# Altium schematic sheet Digital.SchDoc
size A4
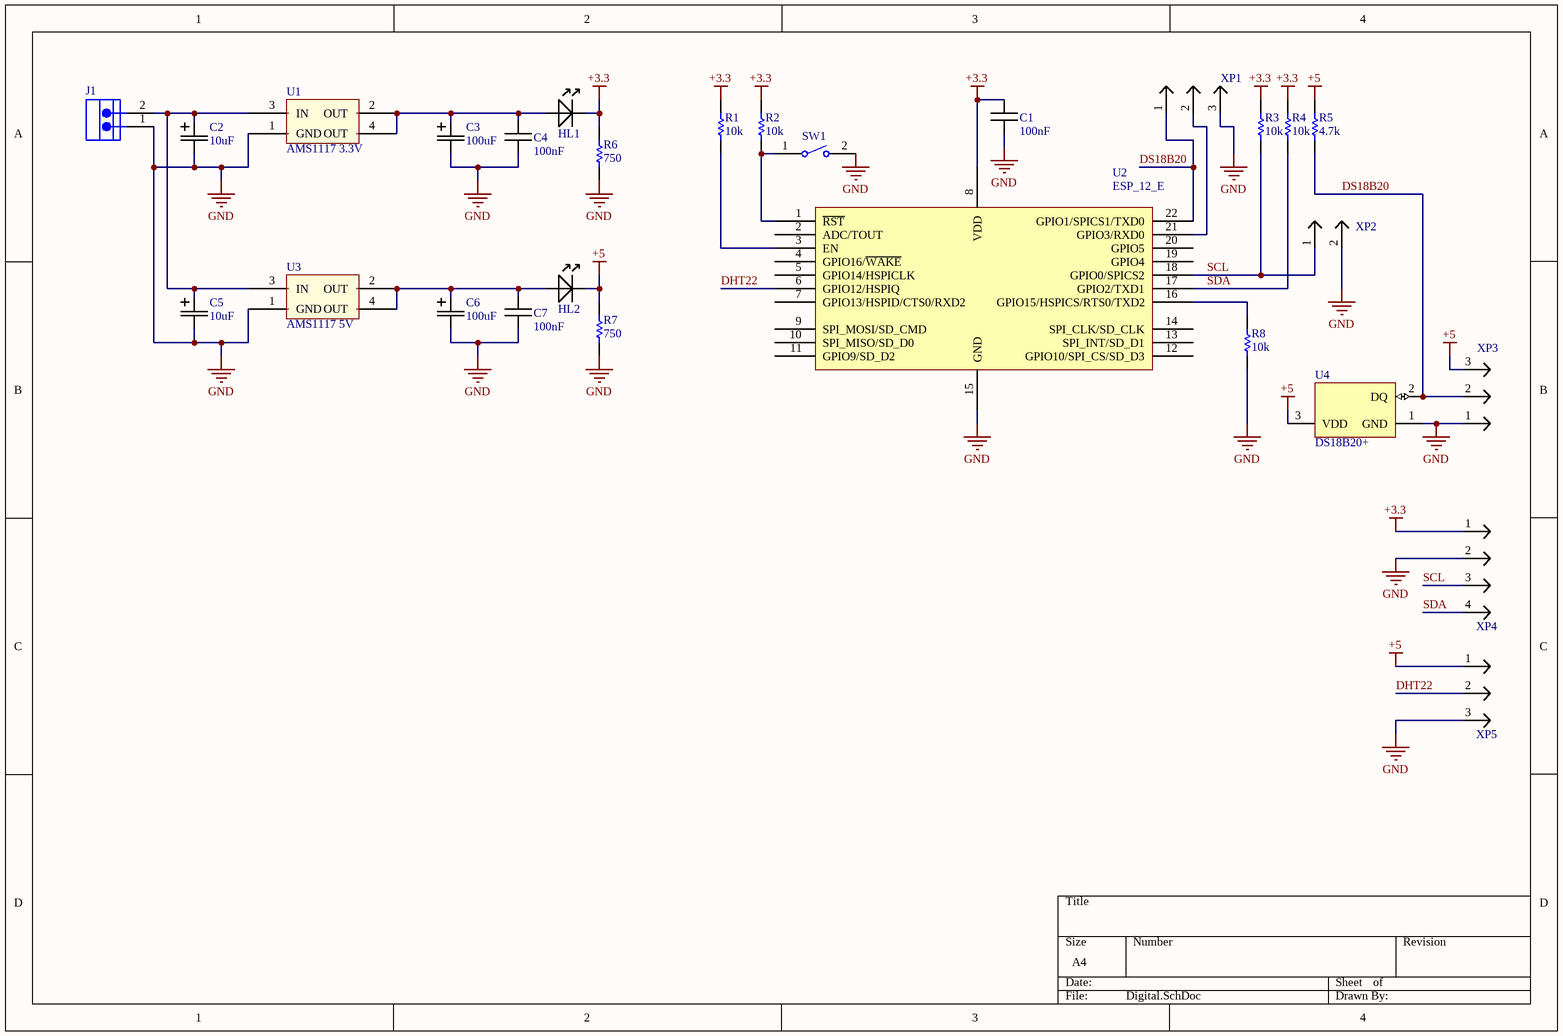
[diagram p0: Digital.SchDoc]

## Parts
C1  Val: 100nF  [CAP0805]  (hidden comment: CAP_SMD)
C2  Val: 10uF  [CAP_ELEC_5*11]  (hidden comment: CAP_ELEC_5*11)
C3  Val: 100uF  [CAP_ELEC_8*11]  (hidden comment: CAP_ELEC_8*11)
C4  Val: 100nF  [CAP0805]  (hidden comment: CAP_SMD)
C5  Val: 10uF  [CAP_ELEC_5*11]  (hidden comment: CAP_ELEC_5*11)
C6  Val: 100uF  [CAP_ELEC_8*11]  (hidden comment: CAP_ELEC_8*11)
C7  Val: 100nF  [CAP0805]  (hidden comment: CAP_SMD)
HL1  LED_SMD  [1206_Led]  (value not drawn)
HL2  LED_SMD  [1206_Led]  (value not drawn)
J1  (no value)  [KF350-3.5-02P]
R1  Val: 10k  [RES0805]  (hidden comment: RES_SMD)
R2  Val: 10k  [RES0805]  (hidden comment: RES_SMD)
R3  Val: 10k  [RES0805]  (hidden comment: RES_SMD)
R4  Val: 10k  [RES0805]  (hidden comment: RES_SMD)
R5  Val: 4.7k  [RES0805]  (hidden comment: RES_SMD)
R6  Val: 750  [RES0805]  (hidden comment: RES_SMD)
R7  Val: 750  [RES0805]  (hidden comment: RES_SMD)
R8  Val: 10k  [RES0805]  (hidden comment: RES_SMD)
SW1  (no value)  [SMD_BUT_6.3mm]
U1  AMS1117 3.3V  [SOT223-4]
U2  ESP_12_E  [ESP_12_E]
U3  AMS1117 5V  [SOT223-4]
U4  DS18B20+  [Q3+1]
XP1  PLS-03  [PLS-03]  (value not drawn)
XP2  PLS-02  [PLS-02]  (value not drawn)
XP3  PLS-03  [PLS-03]  (value not drawn)
XP4  PBS-04  [PBS-04]  (value not drawn)
XP5  PBS-03  [PBS-03]  (value not drawn)

## Nets
+3.3: C1.2 HL1.2(cathode) R1.2 R2.2 R3.2 R4.2 R6.2 U2.8(VDD) XP4.1
+5: HL2.2(cathode) R5.2 R7.2 U4.3(VDD) XP3.3 XP5.1
GND: C1.1 C2.1 C3.1 C4.1 C5.1 C6.1 C7.1 J1.1 R6.1 R7.1 R8.1 SW1.2 U1.1(GND) U2.15(GND) U3.1(GND) U4.1(GND) XP1.3 XP2.2 XP3.1 XP4.2 XP5.3
DHT22: U2.6(GPIO12/HSPIQ) XP5.2
DS18B20: R5.1 U2.22(GPIO1/SPICS1/TXD0) U4.2(DQ) XP1.1 XP3.2
SCL: R3.1 U2.18(GPIO0/SPICS2) XP2.1 XP4.3
SDA: R4.1 U2.17(GPIO2/TXD1) XP4.4
NetC2_2: C2.2 C5.2 J1.2 U1.3(IN) U3.3(IN)
NetC3_2: C3.2 C4.2 HL1.1(anode) U1.2(OUT) U1.4(OUT)
NetC6_2: C6.2 C7.2 HL2.1(anode) U3.2(OUT) U3.4(OUT)
NetR1_1: R1.1 U2.3(EN)
NetR2_1: R2.1 SW1.1 U2.1(~{RST})
NetR8_2: R8.2 U2.16(GPIO15/HSPICS/RTS0/TXD2)
NetU2_21: U2.21(GPIO3/RXD0) XP1.2

Not connected (* = marked no-connect by the designer): U2 2(ADC/TOUT) 4(GPIO16/~{WAKE}) 5(GPIO14/HSPICLK) 7(GPIO13/HSPID/CTS0/RXD2) 9(SPI_MOSI/SD_CMD) 10(SPI_MISO/SD_D0) 11(GPIO9/SD_D2) 12(GPIO10/SPI_CS/SD_D3) 13(SPI_INT/SD_D1) 14(SPI_CLK/SD_CLK) 19(GPIO4) 20(GPIO5)

## Library data of the parts
C1 C4 C7 = CAP_SMD: Ceramic capacitor, 0805
C2 C5 = CAP_ELEC_5*11: Electrolitic capacitor
C3 C6 = CAP_ELEC_8*11: Electrolitic capacitor
HL1 HL2 = LED_SMD: 0805 led
J1 = Terminal_2: Euro Terminal Block, 6 A, 150 V, -40 to 105 degC, Pitch 2.54 mm, 1x2 Position, Height 8.6 mm, Tail Length 3.3 mm; Manufacturer: Cixi KaiFeng; PartNumber: KF120-02P-14; Rated Current: 6 A; Contact: Brass; Insulation Resistance: 5000 MOhm / 1000 V; Rated Voltage: 150 V; No. of Pole: 2; Withstanding Voltage: AC 1500 V / 1 Min; Contact Resistance: 20 mOhm; Pitch: Single Pitch; PackageReference: KF120-2; Color: Green; Mounting Technology: Through Hole; PackageDescription: Terminal Block, Pitch 2.54 mm, 1 x 2 Position, Height 8.6 mm, Tail Length 3.3 mm; ComponentLink2Description: Datasheet; ComponentLink1Description: Manufacturer URL; ComponentLink2URL: http://www.nb-kaifeng.com/upload/editor/ext_pdf/201305290533202245.pdf; Temp. Range: -40 to 105 degC; ComponentLink1URL: http://www.nb-kaifeng.com/
SW1 = Button_2_SMD: Manufacturer: TE Connectivity; Actuator Length: 1.07mm; Electrical Life: 20000Cycles; Actuator Material: Polyamide; Current Rating: 50mA; Illumination Type: Illuminated; Voltage Rating (DC): 24V; Contact Resistance: 100mOhm; Case\/Package: SMD/SMT; Operating Force: 180gf; Switch Travel: 0.25mm; Max Voltage Rating (DC): 12V; Throw Configuration: SPST; Packaging: LoosePiece; Max Operating Temperature: 85degC; ELV: Compliant; Package Description: 2-Pin Surface Mount Device, Body 6 x 3.5 mm, Pitch 9.19 mm; RoHSCompliant: true; Manufacturer URL: http://www.te.com/; Contact Plating: Silver; Contact Material: Brass; Mounting Technology: SurfaceMount; Contact Current Rating: 50mA; Datasheet Version: Rev. C2, 08/2014; Datasheet URL: http://www.te.com/commerce/DocumentDelivery/DDEController?Action=showdoc&DocId=Customer+Drawing%7F1437566-3%7FC2%7Fpdf%7FEnglish%7FENG_CD_1437566-3_C2_1437566_3_1_c.dwg.pdf%7F1437566-3; Mechanical Life: 20000Cycles; Package Reference: FSMSM; REACH SVHC: Unknown; Orientation: Straight; Min Operating Temperature: -35degC; Lead Free: LeadFree; Termination: GullWing; Package Quantity: 1000; Mount: SurfaceMount
U1 U3 = AMS1117: Voltage regulator
U2 = ESP_12_E: ESP-12 Wi-Fi Module by AI-Thinker; IC: ESP8266-EX; Vendor: Ai-thinker
U4 = DS18B20: Programmable Resolution Digital Thermometer, 1-Wire Interface, ±0.5°C Accuracy, 3-Pin TO92, -55°C to +125°C, Pb-Free; ComponentLink2URL: http://datasheets.maxim-ic.com/en/ds/DS18B20.pdf; PackageReference: Q3+1; ComponentLink1Description: Manufacturer URL; PackageDescription: TO-92 Package, Body Dia. 4.7mm; Leads 0.51 x 0.51 mm (max), Pb-Free; DatasheetVersion: 2007; Code_JEDEC: TO-226-AA; ComponentLink1URL: http://www.maxim-ic.com; PackageVersion: revB, 2009; ComponentLink2Description: Datasheet